# EAGLE design body-board (EAGLE 9.6.2)
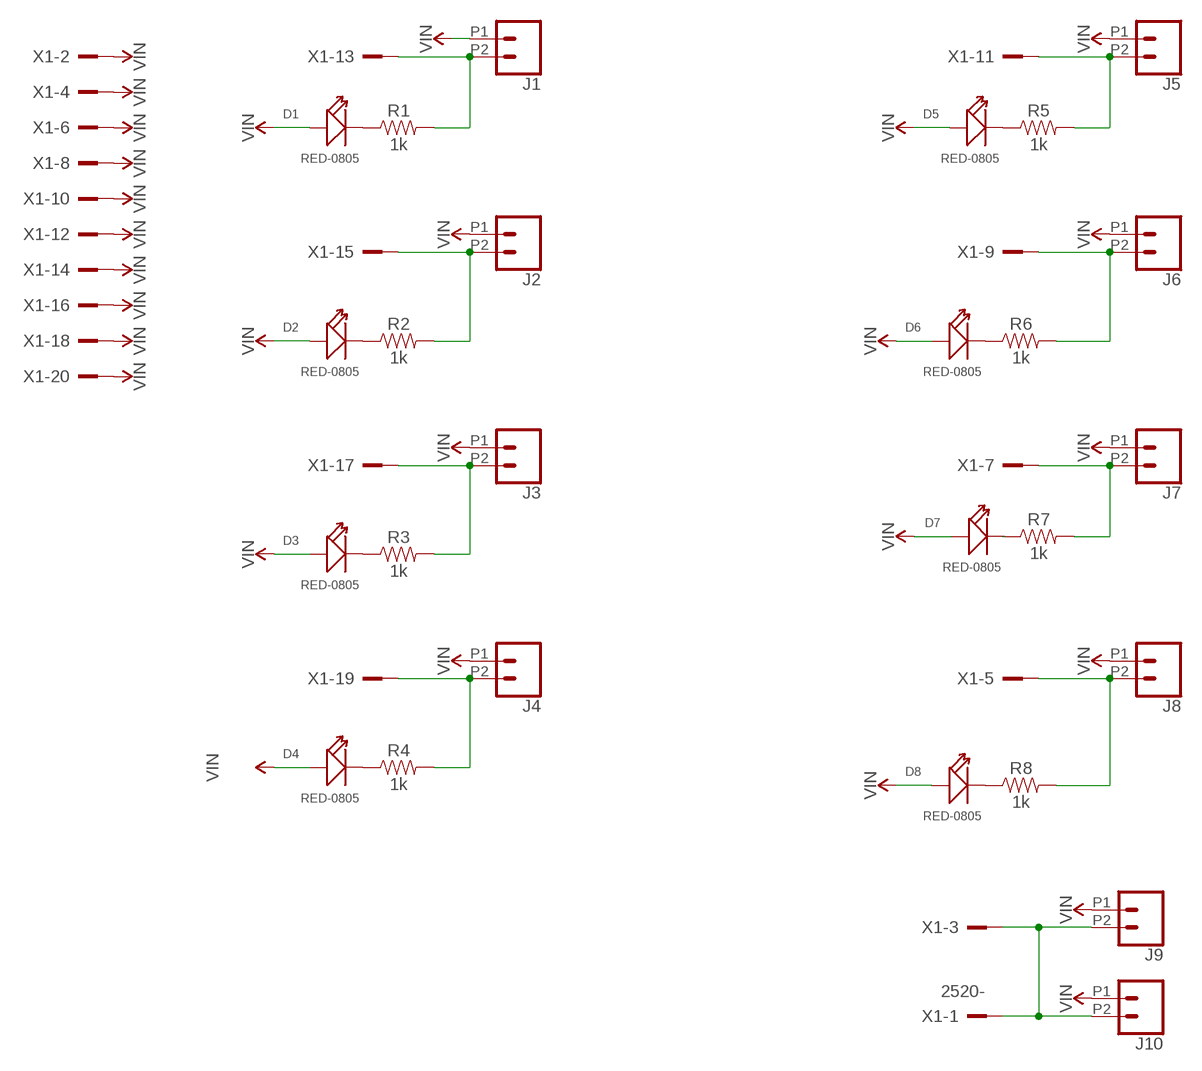
[diagram p0: schematic, sheet 1]

## Parts
D1  RED-0805  SMD-LED-CLEAR-RED(0805)  [LED-0805]
D2  RED-0805  SMD-LED-CLEAR-RED(0805)  [LED-0805]
D3  RED-0805  SMD-LED-CLEAR-RED(0805)  [LED-0805]
D4  RED-0805  SMD-LED-CLEAR-RED(0805)  [LED-0805]
D5  RED-0805  SMD-LED-CLEAR-RED(0805)  [LED-0805]
D6  RED-0805  SMD-LED-CLEAR-RED(0805)  [LED-0805]
D7  RED-0805  SMD-LED-CLEAR-RED(0805)  [LED-0805]
D8  RED-0805  SMD-LED-CLEAR-RED(0805)  [LED-0805]
J1  CONN_022.54MM_SCREWTERM  [1X02_2.54_SCREWTERM]
J2  CONN_022.54MM_SCREWTERM  [1X02_2.54_SCREWTERM]
J3  CONN_022.54MM_SCREWTERM  [1X02_2.54_SCREWTERM]
J4  CONN_022.54MM_SCREWTERM  [1X02_2.54_SCREWTERM]
J5  CONN_022.54MM_SCREWTERM  [1X02_2.54_SCREWTERM]
J6  CONN_022.54MM_SCREWTERM  [1X02_2.54_SCREWTERM]
J7  CONN_022.54MM_SCREWTERM  [1X02_2.54_SCREWTERM]
J8  CONN_022.54MM_SCREWTERM  [1X02_2.54_SCREWTERM]
J9  CONN_022.54MM_SCREWTERM  [1X02_2.54_SCREWTERM]
J10  CONN_022.54MM_SCREWTERM  [1X02_2.54_SCREWTERM]
R1  1k  1KOHM-0603-1/10W-1%  [0603]
R2  1k  1KOHM-0603-1/10W-1%  [0603]
R3  1k  1KOHM-0603-1/10W-1%  [0603]
R4  1k  1KOHM-0603-1/10W-1%  [0603]
R5  1k  1KOHM-0603-1/10W-1%  [0603]
R6  1k  1KOHM-0603-1/10W-1%  [0603]
R7  1k  1KOHM-0603-1/10W-1%  [0603]
R8  1k  1KOHM-0603-1/10W-1%  [0603]
X1  2520-  [PAK100/2500-20]

## Nets
N$1: D1.- R1.1
N$2: D2.- R2.1
N$3: D3.- R3.1
N$4: D4.- R4.1
N$5: D6.- R6.1
N$6: D8.- R8.1
N$8: J9.P2 J10.P2 X1.1 X1.3
N$9: J8.P2 R8.2 X1.5
N$10: J7.P2 R7.2 X1.7
N$11: J6.P2 R6.2 X1.9
N$12: J5.P2 R5.2 X1.11
N$13: J1.P2 R1.2 X1.13
N$14: J2.P2 R2.2 X1.15
N$15: J3.P2 R3.2 X1.17
N$16: J4.P2 R4.2 X1.19
N$17: D7.- R7.1
N$18: D5.- R5.1
VIN: D1.+ D2.+ D3.+ D4.+ D5.+ D6.+ D7.+ D8.+ J1.P1 J2.P1 J3.P1 J4.P1 J5.P1 J6.P1 J7.P1 J8.P1 J9.P1 J10.P1 X1.2 X1.4 X1.6 X1.8 X1.10 X1.12 X1.14 X1.16 X1.18 X1.20

## Library data of the parts
D1-D8 = OPL_Optoelectronics:SMD-LED-CLEAR-RED(0805): 304090046; MPN: 17-215SURC/S530-A2/TR8
J1-J10 = SparkFun-Connectors:CONN_02: Multi connection point. Often used as Generic Header-pin footprint for 0.1 inch spaced/style header connections On any of the 0.1 inch spaced packages, you can populate with these: Break Away Headers - Straight <https://www.sparkfun.com/products/116> (PRT-00116) Break Away Male Headers - Right Angle <https://www.sparkfun.com/products/553> (PRT-00553) Female Headers <https://www.sparkfun.com/products/115> (PRT-00115) Break Away Headers - Machine Pin <https://www.sparkfun.com/products/117> (PRT-00117) Break Away Female Headers - Swiss Machine Pin <https://www.sparkfun.com/products/743> (PRT-00743) For SCREWTERMINALS and SPRING TERMINALS visit here: Screw Terimnals on SparkFun.com <https://www.sparkfun.com/search/results?term=Screw+Terminals> (5mm/3.5mm/2.54mm spacing) This device is also useful as a general connection point to wire up your design to another part of your project. Our various solder wires solder well into these plated through hole pads. Hook-Up Wire - Assortment (Stranded, 22 AWG) <https://www.sparkfun.com/products/11375> (PRT-11375) Hook-Up Wire - Assortment (Solid Core, 22 AWG) <https://www.sparkfun.com/products/11367> (PRT-11367) View the entire wire category on our website here <https://www.sparkfun.com/categories/141> Special notes: Molex polarized connector foot print use with: PRT-08233 with associated crimp pins and housings. 2.54_SCREWTERM for use with PRT-10571. 3.5mm Screw Terminal footprints for PRT-08084 5mm Screw Terminal footprints for use with PRT-08432
R1-R8 = SparkFun-Resistors:1KOHM: 1kΩ resistor A resistor is a passive two-terminal electrical component that implements electrical resistance as a circuit element. Resistors act to reduce current flow, and, at the same time, act to lower voltage levels within circuits. - Wikipedia; PROD_ID: RES-07856
X1 = con-3m:2520-: 3M (TM) Pak 100 4-Wall Header Source: 3M; OC_FARNELL: unknown; OC_NEWARK: unknown

## Board
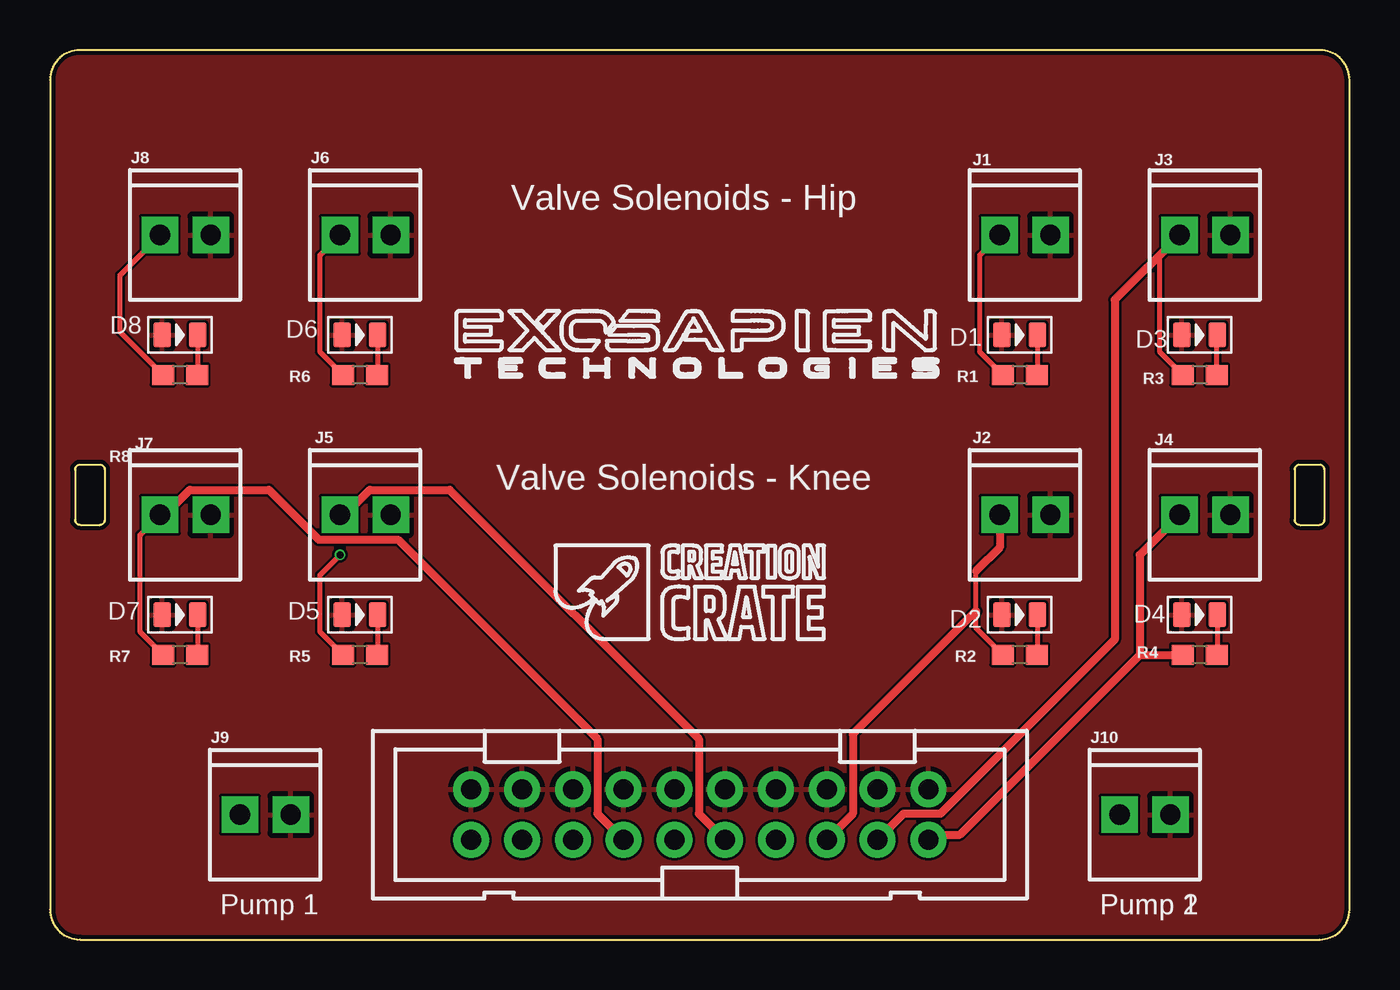
[diagram p1: board, top side]
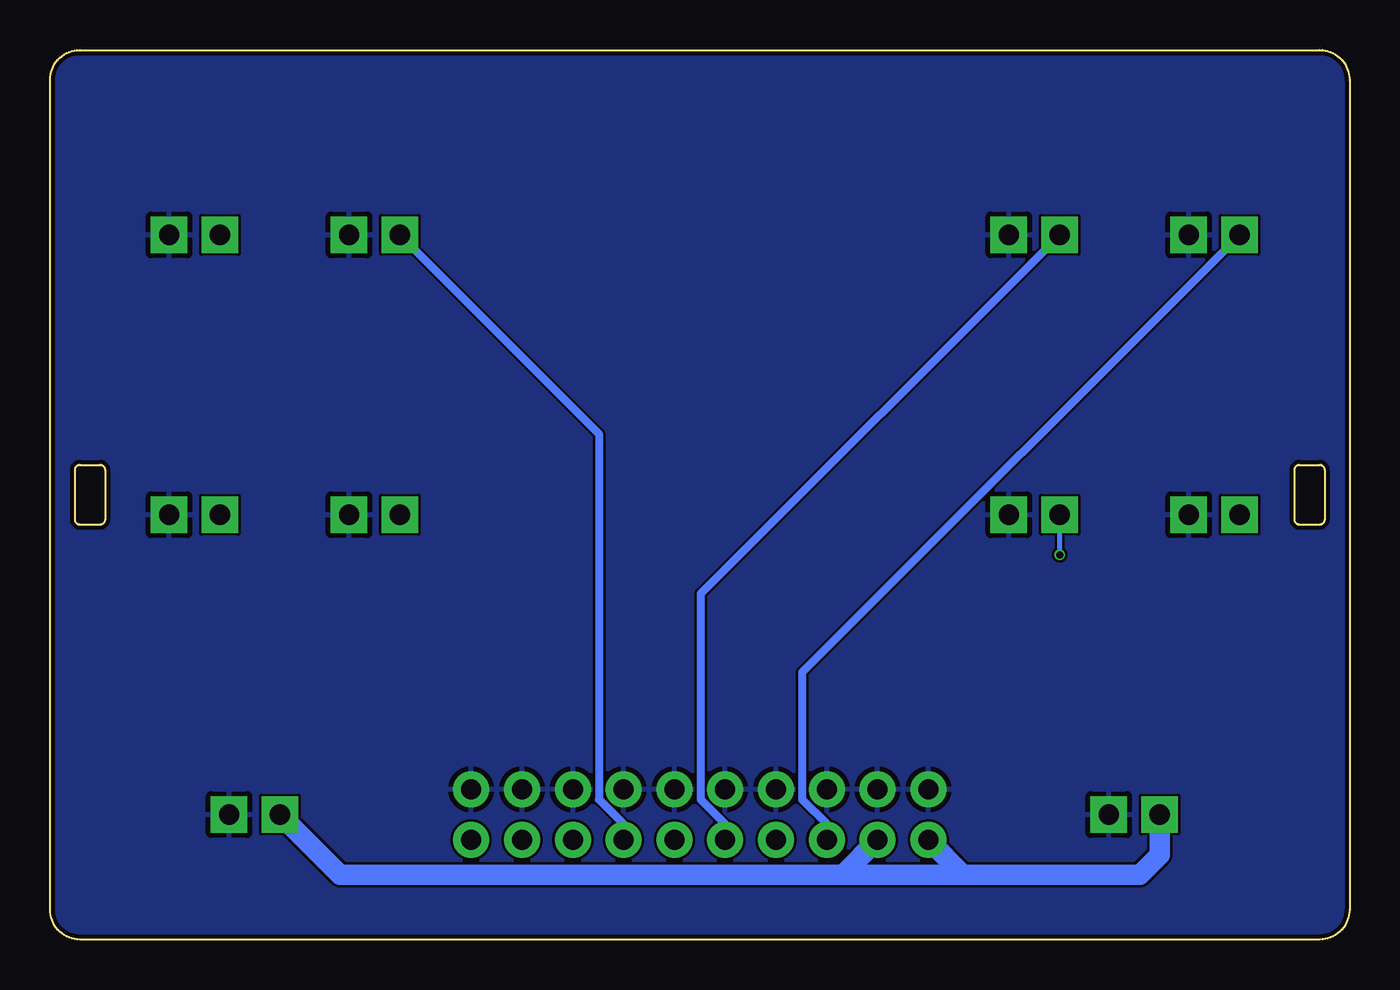
[diagram p2: board, bottom side, seen from below]

Size 65 x 44.5 mm. Coordinates in mm from the lower left corner, seen from the top.
Outline: 63.5,44.5 1.5,44.5 arc90 0,43 0,1.5 arc90 1.5,0 63.5,0 arc90 65,1.5 65,43 arc90 63.5,44.5
Outline: 63.75,21 63.75,23.5 arc90 63.5,23.75 62.5,23.75 arc90 62.25,23.5 62.25,21 arc90 62.5,20.75 63.5,20.75 arc90 63.75,21
Outline: 2.5,23.75 1.5,23.75 arc90 1.25,23.5 1.25,21 arc90 1.5,20.75 2.5,20.75 arc90 2.75,21 2.75,23.5 arc90 2.5,23.75
Copper layers (1*16): Top 0.035mm / dielectric 1.6mm / Bottom 0.035mm
Design rules "jlcpcb-2layers": minimum track width 5mil, minimum drill 0.3mm, track to track 5mil, track to pad 5mil, pad to pad 5mil, via to via 5mil, smd to smd 5mil, copper to edge 0.2mm, drill to drill 6mil, minimum pad ring 10mil, minimum via ring 3mil, stop-mask expansion 4mil, vias tented up to drill 0mil, thermal gap 10mil

### Footprints (pad centres in the part's own frame; a part is rotated, then mirrored left to right if it is on the bottom)
LED-0805 = smd 0.889 x 1.27: + -0.889,0; - 0.889,0
1X02_2.54_SCREWTERM = drill 1.016 square: P1 2.54,0; P2 0,0
0603 = smd 1.1 x 1: 1 -0.85,0; 2 0.85,0
PAK100/2500-20 = drill 1 pad 1.422: 1 -11.43,-1.27; 2 -11.43,1.27; 3 -8.89,-1.27; 4 -8.89,1.27; 5 -6.35,-1.27; 6 -6.35,1.27; 7 -3.81,-1.27; 8 -3.81,1.27; 9 -1.27,-1.27; 10 -1.27,1.27; 11 1.27,-1.27; 12 1.27,1.27; 13 3.81,-1.27; 14 3.81,1.27; 15 6.35,-1.27; 16 6.35,1.27; 17 8.89,-1.27; 18 8.89,1.27; 19 11.43,-1.27; 20 11.43,1.27

### Placement (x,y rotation side)
D1  48.5,30.25 0 top
D2  48.5,16.25 0 top
D3  57.5,30.25 0 top
D4  57.5,16.25 0 top
D5  15.5,16.25 0 top
D6  15.5,30.25 0 top
D7  6.5,16.25 0 top
D8  6.5,30.25 0 top
J1  47.5,35.25 0 top
J2  47.5,21.25 0 top
J3  56.5,35.25 0 top
J4  56.5,21.25 0 top
J5  14.5,21.25 0 top
J6  14.5,35.25 0 top
J7  5.5,21.25 0 top
J8  5.5,35.25 0 top
J9  9.5,6.25 0 top
J10  53.5,6.25 0 top
R1  48.5,28.25 180 top
R2  48.5,14.25 180 top
R3  57.5,28.25 180 top
R4  57.5,14.25 180 top
R5  15.5,14.25 180 top
R6  15.5,28.25 180 top
R7  6.5,14.25 180 top
R8  6.5,28.25 180 top
X1  32.5,6.25 0 top

### Tracks (layer width: path | path; a pad name or v marks a point on that pad's centre or on a via)
N$1
  Top 0.254: D1.- 49.39,28.29 R1.1
N$2
  Top 0.254: D2.- 49.39,14.29 R2.1
N$3
  Top 0.254: R3.1 58.35,30.21 D3.-
N$4
  Top 0.254: D4.- 58.39,14.29 R4.1
N$5
  Top 0.254: D6.- 16.39,28.29 R6.1
N$6
  Top 0.254: D8.- 7.39,28.29 R8.1
N$8
  Bottom 1.016: X1.1 19.34,3.25 | 19.34,3.25 10.5,3.25 9.5,4.25 J9.P2 | J10.P2 50.5,3.25 25.5,3.25 25.34,3.25 | 25.34,3.25 19.34,3.25 | X1.3 25.34,3.25
N$9
  Top 0.254: R8.2 3.5,30.4 3.5,33.25 J8.P2
  Bottom 0.406: X1.5 26.15,5.78 27.38,7.01 27.38,13.37 J8.P2
N$10
  Top 0.254: R7.2 4.5,15.4 4.5,20.25 J7.P2
  Top 0.406: J7.P2 5.74,21.25 6.99,22.5 10.96,22.5 13.45,20 17.4,20 27.38,10.03 27.38,6.29 X1.7
N$11
  Top 0.254: R6.2 13.5,29.4 13.5,34.25 J6.P2
  Bottom 0.406: X1.9 31.23,5.78 32.46,7.01 32.46,17.29 J6.P2
N$12  (via drill 0.35)
  Top 0.254: R5.2 13.5,15.4 13.5,18.25 v14.5,19.25
  Top 0.406: J5.P2 14.74,21.25 15.99,22.5 20,22.5 32.46,10.03 32.46,6.29 X1.11
  Bottom 0.254: v14.5,19.25 J5.P2
N$13
  Top 0.254: R1.2 46.5,29.4 46.5,34.25 J1.P2
  Bottom 0.406: X1.13 36.31,5.78 37.54,7.01 37.54,25.29 J1.P2
N$14
  Top 0.254: R2.2 46.31,15.59 46.31,16.43 46.31,18.43
  Top 0.406: J2.P2 47.5,19.62 46.31,18.43 | 46.31,16.43 40.16,10.28 40.16,6.29 X1.15
N$15
  Top 0.254: R3.2 55.5,29.4 55.5,34.25 J3.P2
  Top 0.406: X1.17 42.7,6.29 44.54,6.29 53.26,15.01 53.26,32 J3.P2
N$16
  Top 0.406: X1.19 44.2,5.25 45.5,5.25 54.5,14.25 | 54.5,14.25 R4.2 | J4.P2 54.5,19.25 54.5,14.25
N$17
  Top 0.254: D7.- 7.39,14.29 R7.1
N$18
  Top 0.254: D5.- 16.39,14.29 R5.1
VIN
  pour Top: -2.5,1.25 -1.5,-1.75 68.13,-1.75 67.5,45.25 -2.5,45.25
  pour Bottom: -3.38,0.13 -1.5,-1.75 66.5,-1.75 66.5,44.25 65.5,45.25 -1.5,45.25

### Text on the board
tNames: Valve Solenoids - Hip | Valve Solenoids - Knee | Pump 1 | Pump 1 | Pump 2